# Altium schematic sheet 3V3_DCDC_Convertor.SchDoc: 3V3 DCDC Convertor
size A4
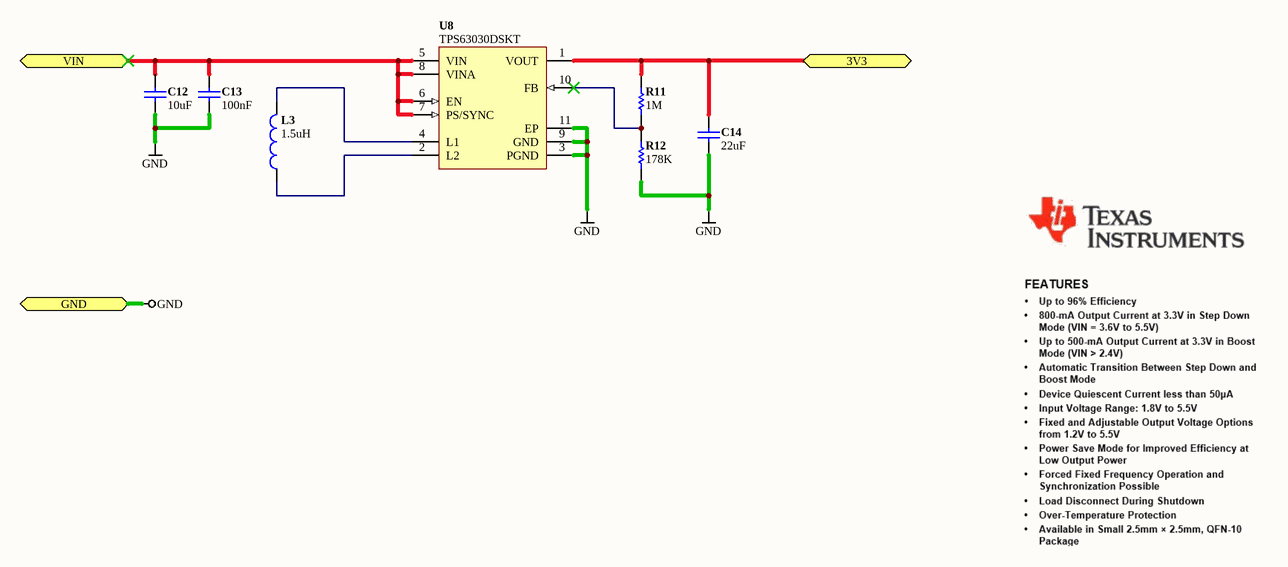
[diagram p0: 3V3_DCDC_Convertor.SchDoc]

## Parts
C12  value 10uF  [CAPC0603(1608)100_N]  (hidden comment: CAP 10uF 10V 0603(1608))
C13  value 100nF  [CAPC0402(1005)60_N]  (hidden comment: CAP 100nF 25V 0402(1005))
C14  value 22uF  [CAPC0805(2012)145_L]  (hidden comment: CAP 22uF 10V 0805(2012))
L3  1.5uH  [SUMI-CDRH2D14NP-1R5NC-2_V]
R11  1M  [RESC0402(1005)_M]
R12  178K  [RESC0402(1005)_L]
U8  TPS63030DSKT  [TI-DSK10-2000X1200TP_V]

## Ports
3V3, GND, VIN

## Nets
GND: C12.1 C13.2 C14.1 R12.1 U8.3(PGND) U8.9(GND) U8.11(EP) ; port GND
3V3: C14.2 R11.2 U8.1(VOUT) ; port 3V3
VIN: C12.2 C13.1 U8.5(VIN) U8.6(EN) U8.7(PS/SYNC) U8.8(VINA) ; port VIN
NetL3_1: L3.1 U8.2(L2)
NetL3_2: L3.2 U8.4(L1)
NetR11_1: R11.1 R12.2 U8.10(FB)

## Notes on the sheet
- Sheet Title
- Project Title
- Size:
- Date:
- A4
- Item:
- Time:
- Revision:
- Sheet
- of
- File:

## Library data of the parts
C12 = CMP-1035-02799-1: CAP 10uF 10V ±10% 0603 (1608 Metric) Thickness 1mm SMD; Case-Metric: 1608; Case-EIA: 0603; Max Thickness: 1 mm; Tolerance: ±10%; Technology: SMT; Rated Voltage: 10 V
C13 = CMP-1034-02073-1: CAP 100nF 25V ?0% 0402 (1005 Metric) Thickness 0.6mm SMD; Case-EIA: 0402; Case-Metric: 1005; Rated Voltage: 25 V; Tolerance: ?0%; Max Thickness: 0.6 mm; Technology: SMT
C14 = CMP-1036-04942-1: CAP 22uF 10V ±10% 0805 (2012 Metric) Thickness 1.45mm SMD; Case-EIA: 0805; Case-Metric: 2012; Rated Voltage: 10 V; Max Thickness: 1.45 mm; Technology: SMT; Tolerance: ±10%
L3 = CMP-0468-00001-1: Power Inductor,-40 to 100 degC, 3.2 x 3.2 x 1.55 mm, SMD; Manufacturer: Sumida; PartNumber: CDRH2D14NP-1R5NC; Temperature Rise Current(A): 2; Stamp: A; D.C.R.(mOhm) Max.(Typ.)(at 20degC): 63(50); Saturation Current(A) at 20degC: 1.8; Inductance(uH)[within]: 1.5 +/- 30%; Packing: Tape and Reel; Saturation Current(A) at 100degC: 1.2; PackageReference: CDRH2D14NP-1R5NC-2; PackageDescription: 2-Pin Hand Drawn, Body 3 x 3mm, Pitch 3 mm; ComponentLink1URL: http://www.sumida.com; DatasheetVersion: 17.09.12; ComponentLink2URL: http://www.sumida.com/products/pdf/CDRH2D14.pdf; ComponentLink3Description: Package Specification; Operating Temperature: -40 to 100 degC; ComponentLink1Description: Manufacturer URL; ComponentLink2Description: Datasheet; Mounting Technology: Surface Mount; ComponentLink3URL: http://www.sumida.com/products/pdf/CDRH2D14.pdf
R11 = CMP-1011-00849-1: 1M 0.063W 1% 0402 (1005 Metric)  SMD; Case-Metric: 1005; Value: 1000000.00 Ohm; Case-EIA: 0402; Tolerance: 1 %; Power: 0.063 W; Technology: SMT
R12 = CMP-1011-00762-1: 178K 0.063W 1% 0402 (1005 Metric)  SMD; Case-Metric: 1005; Case-EIA: 0402; Value: 178000.00 Ohm; Technology: SMT; Power: 0.063 W; Tolerance: 1 %
U8 = CMP-0349-00012-1: High Efficiency Single Inductor Buck-Boost Converter with 1-A Switch,1.2 to 5.5 V Output, -40 to 85 degC, 10-pin SON (DSK), Green(RoHS & no Sb/Br); Manufacturer: Texas Instruments; Iout (Max) (A): 0.8; Regulated Outputs (#): 1; Vin(Min)(V): 1.8; Vout (Min) (V): 1.2; Shutdown Current (Typ) (uA): 0.1; Vout (Max) (V): 5.5; Iq (Typ) (mA): 0.025; PackageVersion: 4208566/A; Operating Temperature: -40 to 85 degC; PartNumber: TPS63030DSKT; ComponentLink3Description: Package Specification; DatasheetVersion: SLVS696B; PackageDescription: 10-Pin Plastic Small Outline, Body 2.5 x 2.5 mm, Pitch 0.5 mm; ComponentLink1URL: http://www.ti.com/; ComponentLink2Description: Datasheet; ComponentLink3URL: http://www.ti.com/lit/ml/mpds326/mpds326.pdf; ComponentLink2URL: http://www.ti.com/lit/ds/symlink/tps63030.pdf; ComponentLink1Description: Manufacturer URL; Switch Current Limit (Typ) (A): 1; Vin (Max) (V): 5.5; PackageReference: DSK-10; Mounting Technology: Surface Mount